# Altium schematic sheet Sensor Connection.SchDoc: Sensor Connection
size A4; DocumentNumber: 10; SheetNumber: 10; SheetTotal: 45
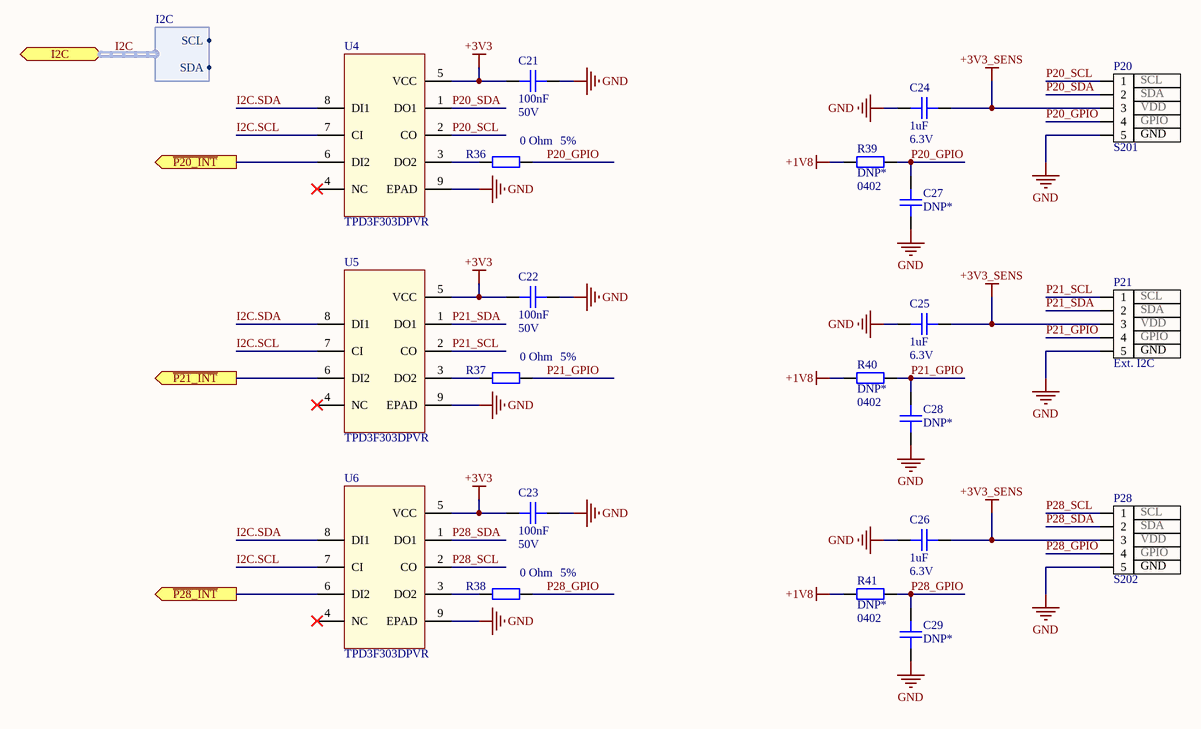
[diagram p0: Sensor Connection.SchDoc]

## Parts
C21  Capacitance: 100nF  Voltage: 50V  [CAP_0402]  (hidden comment: CAP CER 0.1UF 50V X7R 0402)
C22  Capacitance: 100nF  Voltage: 50V  [CAP_0402]  (hidden comment: CAP CER 0.1UF 50V X7R 0402)
C23  Capacitance: 100nF  Voltage: 50V  [CAP_0402]  (hidden comment: CAP CER 0.1UF 50V X7R 0402)
C24  Capacitance: 1uF  Voltage Rating: 6.3V  [CAP_0402]  (hidden comment: CAP CER 1UF 6.3V X5R 0402)
C25  Capacitance: 1uF  Voltage Rating: 6.3V  [CAP_0402]  (hidden comment: CAP CER 1UF 6.3V X5R 0402)
C26  Capacitance: 1uF  Voltage Rating: 6.3V  [CAP_0402]  (hidden comment: CAP CER 1UF 6.3V X5R 0402)
C27  DNP*  [C0402]  (no BOM)
C28  DNP*  [C0402]  (no BOM)
C29  DNP*  [C0402]  (no BOM)
P20  S201  pin_1: SCL  pin_2: SDA  pin_3: VDD  pin_4: GPIO  pin_5: GND  [CONN_S5B-ZR(LF)(SN)]
P21  Ext. I2C  pin_1: SCL  pin_2: SDA  pin_3: VDD  pin_4: GPIO  pin_5: GND  [CONN_S5B-ZR(LF)(SN)]
P28  S202  pin_1: SCL  pin_2: SDA  pin_3: VDD  pin_4: GPIO  pin_5: GND  [CONN_S5B-ZR(LF)(SN)]
R36  Tolerance: 5%  Resistance: 0 Ohm  [0402R]  (hidden comment: RES SMD 0 OHM JUMPER 1/16W 0402)
R37  Tolerance: 5%  Resistance: 0 Ohm  [0402R]  (hidden comment: RES SMD 0 OHM JUMPER 1/16W 0402)
R38  Tolerance: 5%  Resistance: 0 Ohm  [0402R]  (hidden comment: RES SMD 0 OHM JUMPER 1/16W 0402)
R39  DNP*  Case/Package: 0402  [0402R]  (no BOM)
R40  DNP*  Case/Package: 0402  [0402R]  (no BOM)
R41  DNP*  Case/Package: 0402  [0402R]  (no BOM)
U4  TPD3F303DPVR  [DPV8_1P7X0P4]
U5  TPD3F303DPVR  [DPV8_1P7X0P4]
U6  TPD3F303DPVR  [DPV8_1P7X0P4]

## Ports
I2C (harness I2C), ~{P20_INT} (out), ~{P21_INT} (out), ~{P28_INT} (out)

## Harnesses
I2C: SCL, SDA

## Nets
+1V8: R39.2 R40.2 R41.2
+3V3: C21.1 C22.1 C23.1 U4.5(VCC) U5.5(VCC) U6.5(VCC)
+3V3_SENS: C24.2 C25.2 C26.2 P20.3 P21.3 P28.3
GND: C21.2 C22.2 C23.2 C24.1 C25.1 C26.1 C27.1 C28.1 C29.1 P20.5 P21.5 P28.5 U4.9(EPAD) U5.9(EPAD) U6.9(EPAD)
~{P20_INT}: U4.6(DI2) ; port ~{P20_INT}
~{P21_INT}: U5.6(DI2) ; port ~{P21_INT}
~{P28_INT}: U6.6(DI2) ; port ~{P28_INT}
I2C.SCL: U4.7(CI) U5.7(CI) U6.7(CI)
I2C.SDA: U4.8(DI1) U5.8(DI1) U6.8(DI1)
P20_GPIO: C27.2 P20.4 R36.2 R39.1
P20_SCL: P20.1 U4.2(CO)
P20_SDA: P20.2 U4.1(DO1)
P21_GPIO: C28.2 P21.4 R37.2 R40.1
P21_SCL: P21.1 U5.2(CO)
P21_SDA: P21.2 U5.1(DO1)
P28_GPIO: C29.2 P28.4 R38.2 R41.1
P28_SCL: P28.1 U6.2(CO)
P28_SDA: P28.2 U6.1(DO1)
NetR36_1: R36.1 U4.3(DO2)
NetR37_1: R37.1 U5.3(DO2)
NetR38_1: R38.1 U6.3(DO2)

Not connected (* = marked no-connect by the designer): U4 4(NC)*; U5 4(NC)*; U6 4(NC)*

## Buses and harness runs
harness I2C = port I2C

## Notes on the sheet
- Title
- Size:
- Date:
- A4
- Number:
- Time:
- Revision:
- Sheet
- of
- File:

## Library data of the parts
C21-C23 = CAP CER 0.1UF 50V X7R 0402: 0.1µF ±10% 50V Ceramic Capacitor X7R 0402 (1005 Metric); Manufacturer: TDK; Manufacturer Part Number: CGA2B3X7R1H104K050BB; Supplier 1: Digi-Key; Stock 1: 2925303; Pricing 1: 1=0.17, 10=0.118, 50=0.0668, 100=0.0553, 500=0.0388, 1000=0.0321, 2500=0.0299, 5000=0.0273 (USD); Mount: Surface Mount; Case/Package: 0402; Weight: 2.3E-05oz; Case Code (Metric): 1005; Case Code (Imperial): 0402; Min Operating Temperature: -55°C; Max Operating Temperature: 125°C; Voltage Rating: 50V; Tolerance: 10%; Packaging: Tape and Reel; Package Quantity: 1; Voltage Rating (DC): 50V; Dielectric: X7R; Termination: SMD/SMT; Composition: Ceramic; Length: 1mm; Height: 0.5mm; Width: 0.02inch; Thickness: 0.022inch; Depth: 0.5mm; Ratings: AEC-Q200; REACH SVHC: No SVHC; Lead Free: Lead Free; ComponentLink1URL: http://product.tdk.com/capacitor/mlcc/en/documents/mlccspec_automotive_general_midvoltage_en.pdf?src-supplier=Future+Electronics; ComponentLink1Description: http://product.tdk.com/capacitor/mlcc/en/documents/mlccspec_automotive_general_midvoltage_en.pdf?src-supplier=Future+Electronics; ComponentLink2URL: http://www.farnell.com/datasheets/1807242.pdf?src-supplier=Element14; ComponentLink2Description: http://www.farnell.com/datasheets/1807242.pdf?src-supplier=Element14; ComponentLink3URL: http://www.mouser.com/ds/2/400/lcc_automotive_general_en-843974.pdf?src-supplier=Mouser; ComponentLink3Description: http://www.mouser.com/ds/2/400/lcc_automotive_general_en-843974.pdf?src-supplier=Mouser; ComponentLink4URL: http://www.farnell.com/datasheets/1936565.pdf?src-supplier=Element14; ComponentLink4Description: http://www.farnell.com/datasheets/1936565.pdf?src-supplier=Element14; ComponentLink5URL: http://www.farnell.com/datasheets/1735392.pdf?src-supplier=Element14; ComponentLink5Description: http://www.farnell.com/datasheets/1735392.pdf?src-supplier=Element14; Supplier Part Number 1: 445-6899-1-ND
C24-C26 = CAP CER 1UF 6.3V X5R 0402: 1µF ±10% 6.3V Ceramic Capacitor X5R 0402 (1005 Metric); Manufacturer: Yageo; Manufacturer Part Number: CC0402KRX5R5BB105; Supplier 1: Digi-Key; Stock 1: 34926286; Pricing 1: 1=0.1, 10=0.05, 50=0.0272, 100=0.0222, 500=0.0158, 1000=0.0124, 2500=0.0113, 5000=0.0104 (USD); Mount: Surface Mount; Number of Pins: 2; Case Code (Imperial): 0402; Case Code (Metric): 1005; Min Operating Temperature: -55°C; Max Operating Temperature: 85°C; Tolerance: 10%; Packaging: Tape and Reel; Termination: SMD/SMT; Voltage Rating (DC): 6.3V; Composition: Ceramic; Length: 1mm; Height: 0.5mm; Width: 0.02inch; Thickness: 0.022inch; Depth: 0.5mm; Radiation Hardening: No; Lead Free: Lead Free; Halogen Free: Halogen Free; ComponentLink1URL: http://www.farnell.com/datasheets/70765.pdf?src-supplier=Farnell; ComponentLink1Description: http://www.farnell.com/datasheets/70765.pdf?src-supplier=Farnell; Supplier Part Number 1: 311-1438-1-ND; Dielectric: X5R; Case/Package: 0402; Dielectric Material: Ceramic; Package Quantity: 1; REACH SVHC: No SVHC; ComponentLink2URL: http://www.yageo.com/documents/recent/UPY-GPHC_X5R_4V-to-50V_25.pdf?src-supplier=Digi-Key; ComponentLink2Description: http://www.yageo.com/documents/recent/UPY-GPHC_X5R_4V-to-50V_25.pdf?src-supplier=Digi-Key; ComponentLink3URL: http://www.farnell.com/datasheets/2167237.pdf?src-supplier=Element14; ComponentLink3Description: http://www.farnell.com/datasheets/2167237.pdf?src-supplier=Element14; ComponentLink4URL: http://www.yageo.com/documents/recent/UPY-GPHC_X5R_4V-to-50V_12.pdf?src-supplier=Avnet+Europe; ComponentLink4Description: http://www.yageo.com/documents/recent/UPY-GPHC_X5R_4V-to-50V_12.pdf?src-supplier=Avnet+Europe; ComponentLink5URL: http://www.farnell.com/datasheets/1359354.pdf?src-supplier=Element14; ComponentLink5Description: http://www.farnell.com/datasheets/1359354.pdf?src-supplier=Element14; ComponentLink6URL: http://www.farnell.com/datasheets/70765.pdf?src-supplier=Element14; ComponentLink6Description: http://www.farnell.com/datasheets/70765.pdf?src-supplier=Element14; ComponentLink7URL: http://www.yageo.com/documents/recent/UPY-GPHC_X5R_4V-to-50V_12.pdf?src-supplier=Avnet; ComponentLink7Description: http://www.yageo.com/documents/recent/UPY-GPHC_X5R_4V-to-50V_12.pdf?src-supplier=Avnet
C27-C29 = CAP CER NO_BOM 0402: Placeholder for a 0402 capacitor
P20 P21 P28 = CONN HEADER TH R/A 5POS 1.5MM: Connector Header Through Hole, Right Angle 5 position 0.059" (1.50mm); Manufacturer: JST; Manufacturer Part Number: S5B-ZR(LF)(SN); Number of Positions: 5; Gender: Male; Pitch: 1.5mm; Connector Type: Male Pin; Current Rating: 1A; Voltage Rating: 50V; Contact Resistance: 30mR; Supplier 1: Digi-Key; Stock 1: 41138; Pricing 1: 1=0.29, 10=0.272, 100=0.1889, 500=0.1598, 1000=0.1308, 5000=0.1162, 10000=0.1053 (USD); Mount: Through Hole; Housing Material: Polyamide; Contact Plating: Tin,Copper; Color: Natural; Min Operating Temperature: -25°C; Max Operating Temperature: 85°C; Number of Rows: 1; Packaging: Bulk; Termination: Press-Fit; Orientation: Right Angle; Number of Contacts: 5; ComponentLink1URL: http://www.jst-mfg.com/product/pdf/eng/eZH.pdf?src-supplier=Digi-Key; ComponentLink1Description: http://www.jst-mfg.com/product/pdf/eng/eZH.pdf?src-supplier=Digi-Key; Supplier Part Number 1: 455-1672-ND; Housing Color: Beige; Fastening Type: Detent; Length: 9mm; Depth: 6mm; Contact Mating Length: 0.094inch; Number of Pins: 5; Contact Material: Brass,Tin; Max Current Rating: 1A; Max Voltage Rating (AC): 50V; Height: 7.2mm; Width: 3.5mm; Lead Free: Lead Free; ComponentLink2URL: https://www.verical.com/server-webapp/html/getDatasheet?partID=640593&src-supplier=Verical; ComponentLink2Description: https://www.verical.com/server-webapp/html/getDatasheet?partID=640593&src-supplier=Verical; ComponentLink3URL: http://www1.futureelectronics.com/doc/JST/S5B-ZR(LF)(SN).pdf?src-supplier=Future+Electronics; ComponentLink3Description: http://www1.futureelectronics.com/doc/JST/S5B-ZR(LF)(SN).pdf?src-supplier=Future+Electronics; ComponentLink4URL: http://www.produktinfo.conrad.com/datenblaetter/725000-749999/741204-da-01-en-STIFTLEISTE_GEWINKELT_5_POL_RM1_5.pdf?src-supplier=Conrad; ComponentLink4Description: http://www.produktinfo.conrad.com/datenblaetter/725000-749999/741204-da-01-en-STIFTLEISTE_GEWINKELT_5_POL_RM1_5.pdf?src-supplier=Conrad
R36-R38 = RES SMD 0 OHM JUMPER 1/16W 0402: 0 Ohms Jumper 0.063W, 1/16W Chip Resistor 0402 (1005 Metric) Moisture Resistant Thick Film; Manufacturer: Yageo; Manufacturer Part Number: RC0402JR-070RL; Power Rating: 62.5mW; Voltage Rating: 50V; Max Power Dissipation: 63mW; Temperature Coefficient: 200ppm/°C; Supplier 1: Digi-Key; Stock 1: 46057148; Pricing 1: 1=0.1, 10=0.013, 25=0.0092, 50=0.0072, 100=0.0053, 250=0.004, 500=0.0032, 1000=0.0024, 5000=0.0017 (USD); Contact Plating: Tin,Matte; Case Code (Metric): 1005; Case Code (Imperial): 0402; Min Operating Temperature: -55°C; Max Operating Temperature: 155°C; Packaging: Tape and Reel; Composition: Thick Film; Package Quantity: 1; Number of Terminations: 2; Termination: SMD/SMT; Military Standard: Not; Features: Moisture Resistant; Length: 1mm; Height: 0.016inch; Width: 0.02inch; Depth: 0.5mm; Radiation Hardening: No; REACH SVHC: Unknown; Lead Free: Lead Free; ComponentLink1URL: http://www.yageo.com/documents/recent/PYu-RC_Group_51_RoHS_L_10.pdf?src-supplier=Digi-Key; ComponentLink1Description: http://www.yageo.com/documents/recent/PYu-RC_Group_51_RoHS_L_10.pdf?src-supplier=Digi-Key; ComponentLink2URL: http://www.yageo.com/documents/recent/PYu-RC0402_51_RoHS_L_6.pdf?src-supplier=Avnet+Europe; ComponentLink2Description: http://www.yageo.com/documents/recent/PYu-RC0402_51_RoHS_L_6.pdf?src-supplier=Avnet+Europe; ComponentLink3URL: http://www.farnell.com/datasheets/1018594.pdf?src-supplier=Element14; ComponentLink3Description: http://www.farnell.com/datasheets/1018594.pdf?src-supplier=Element14; ComponentLink4URL: https://www.verical.com/server-webapp/html/getDatasheet?partID=326379&src-supplier=Verical; ComponentLink4Description: https://www.verical.com/server-webapp/html/getDatasheet?partID=326379&src-supplier=Verical; ComponentLink5URL: http://www.farnell.com/datasheets/2167052.pdf?src-supplier=Element14; ComponentLink5Description: http://www.farnell.com/datasheets/2167052.pdf?src-supplier=Element14; Supplier Part Number 1: 311-0.0JRCT-ND; Case/Package: 0402
R39-R41 = RES SMD NO BOM 0402: Placeholder for a 0402 resistor
U4-U6 = FILTER RC(PI) ESD SMD  8-UFDFN EP: RC (Pi) EMI Filter 2nd Order Low Pass 3 Channel R = 47Ohms, 100Ohms, C = 20pF  8-UFDFN Exposed Pad; Manufacturer: Texas Instruments; Number of Channels: 3; Operating Supply Voltage: 5.5V; ESD Protection: Yes; Clamping Voltage: 10V; Frequency: 308MHz; Supplier 1: Digi-Key; Manufacturer Part Number: TPD3F303DPVR; Stock 1: 4896; Pricing 1: 1=0.85, 10=0.812, 25=0.7856, 50=0.6414, 100=0.576, 250=0.5236, 500=0.4974, 1000=0.4451 (USD); Case/Package: SMD/SMT; Number of Pins: 8; Contact Plating: Gold; Min Operating Temperature: -40°C; Max Operating Temperature: 85°C; Package Quantity: 1; Packaging: Tape and Reel; Capacitance: 20pF; Termination: Flat; Length: 2.2mm; Height: 0.026inch; Width: 0.063inch; Depth: 1.7mm; Radiation Hardening: No; REACH SVHC: No SVHC; Lead Free: Lead Free; ComponentLink1URL: http://www.ti.com/lit/ds/symlink/tpd3f303.pdf?src-supplier=Digi-Key; ComponentLink1Description: http://www.ti.com/lit/ds/symlink/tpd3f303.pdf?src-supplier=Digi-Key; ComponentLink2URL: http://focus.ti.com/lit/ds/symlink/tpd3f303.pdf?src-supplier=Avnet+Europe; ComponentLink2Description: http://focus.ti.com/lit/ds/symlink/tpd3f303.pdf?src-supplier=Avnet+Europe; ComponentLink3URL: https://www.verical.com/server-webapp/html/getDatasheet?partID=302817&src-supplier=Verical; ComponentLink3Description: https://www.verical.com/server-webapp/html/getDatasheet?partID=302817&src-supplier=Verical; ComponentLink4URL: http://www.farnell.com/datasheets/1558442.pdf?src-supplier=Element14; ComponentLink4Description: http://www.farnell.com/datasheets/1558442.pdf?src-supplier=Element14; Supplier Part Number 1: 296-28299-1-ND